# Altium schematic sheet Battery Board Connector.SchDoc: Battery Board Header
size Letter; SheetNumber: 16
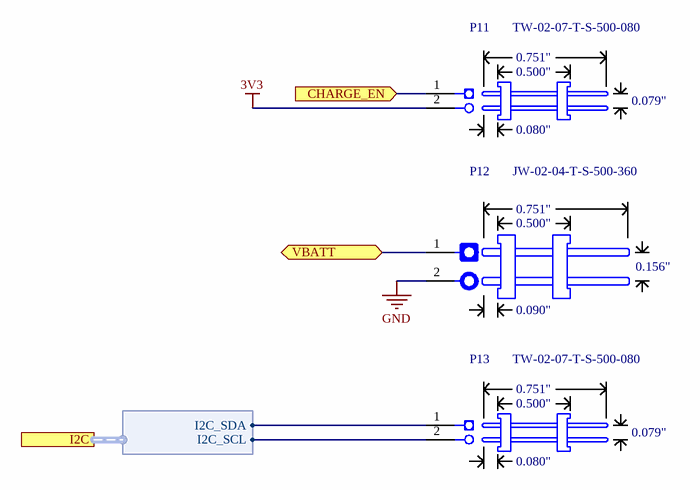
[diagram p0: Battery Board Connector.SchDoc]

## Parts
P11  TW-02-07-T-S-500-080  [SAM-TW-02-07-T-S-500-080]
P12  JW-02-04-T-S-500-360  [SAM-JW-02-04-T-S-500-360]
P13  TW-02-07-T-S-500-080  [SAM-TW-02-07-T-S-500-080]

## Ports
CHARGE_EN (in), I2C (harness TMS570_I2C1), VBATT (bidir)

## Harnesses
TMS570_I2C1: I2C_SCL, I2C_SDA

## Nets
3V3: P11.2
GND: P12.2
CHARGE_EN: P11.1 ; port CHARGE_EN
VBATT: P12.1 ; port VBATT
NetP13_1: P13.1 ; port I2C.I2C_SDA
NetP13_2: P13.2 ; port I2C.I2C_SCL

## Notes on the sheet
- (the "License"); you may not use or redistribute this file except in compliance with the License. You
- This file and the information within it are licensed under the terms of the Apache License, Version 2.0
- Copyright
- Unless required by applicable law or agreed to in writing, content distributed under the License is
- distributed on an "AS IS" BASIS, WITHOUT WARRANTIES OR CONDITIONS OF ANY KIND,
- either express or implied. See the License for the specific language governing permissions and
- limitations under the License.
- may obtain a copy of the License at:
- http://www.apache.org/licenses/LICENSE-2.0
- Title
- Size:
- Date:
- Letter
- Number:
- Time:
- Revision:
- Sheet
- of
- University of Alberta
- Deptartment of Electrical
- and Computer Engineering
- Edmonton AB, Canada
- T6G 1H9
- File:
- (in symbol PP-SAM-00014) 0.751"; 0.500"; 0.079"; 0.080"
- (in symbol PP-SAM-00015) 0.751"; 0.500"; 0.156"; 0.090"

## Library data of the parts
P11 P13 = PP-SAM-00014: CONN BRD STACK 2.00 2POS; Index: 14; Designator: P?; Part Number: PP-SAM-00014; Manufacturer Part Number: TW-02-07-T-S-500-080; Supplier Part Number 1: 200-TW0207TS500080; Supplier 1: Mouser; Publisher: AlbertaSat; Published: 2023-04-18; LatestRevisionDate: 2023-04-18; LatestRevisionNote: ...; Supplier Link: #https://www.digikey.ca/en/products/detail/samtec-inc/TW-02-07-T-S-500-080/9783597#; Operating Temperature: -55°C ~ 125°C
P12 = PP-SAM-00015: .156" Flex Stack, Power Flexible Board Stacker rohs logo; Index: 15; Designator: P?; Part Number: PP-SAM-00015; Manufacturer Part Number: JW-02-04-T-S-500-360; Supplier Part Number 1: JW-02-04-T-S-500-360; Supplier 1: Samtec; Publisher: AlbertaSat; Published: 2023-04-18; LatestRevisionDate: 2023-04-18; LatestRevisionNote: ...; PackageDescription: .156" Flex Stack, Power Flexible Board Stacker rohs logo; Supplier Link: #https://www.samtec.com/products/jw-02-04-t-s-500-360#; Operating Temperature: -55°C ~ 105°C